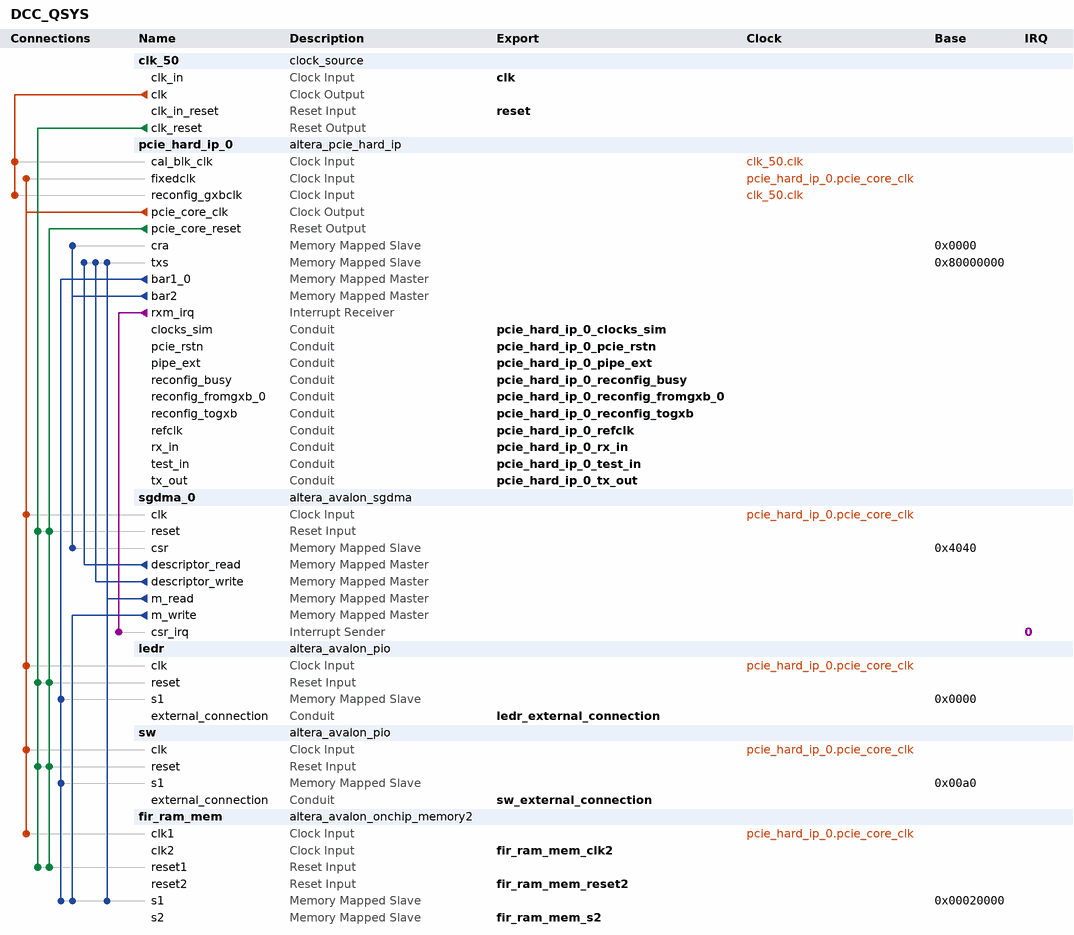
[diagram p0: system contents]
# Platform Designer (Qsys) system DCC_QSYS, Cyclone IV GX EP4CGX150DF31C7
# Parameters at their usual value, and those the tool derives, are not listed.
package require -exact qsys 14.0
create_system DCC_QSYS
set_project_property DEVICE_FAMILY {Cyclone IV GX}
set_project_property DEVICE EP4CGX150DF31C7

add_instance clk_50 clock_source 14.0
set_instance_parameter_value clk_50 clockFrequency 50000000

add_instance pcie_hard_ip_0 altera_pcie_hard_ip 14.0
set_instance_parameter_value pcie_hard_ip_0 p_pcie_test_out_width None
set_instance_parameter_value pcie_hard_ip_0 {BAR Type} {64 bit Prefetchable,Not used,32 bit Non-Prefetchable,Not used,Not used,Not used}
set_instance_parameter_value pcie_hard_ip_0 vendor_id 4466
set_instance_parameter_value pcie_hard_ip_0 device_id 57345
set_instance_parameter_value pcie_hard_ip_0 class_code 0
set_instance_parameter_value pcie_hard_ip_0 subsystem_vendor_id 4466
set_instance_parameter_value pcie_hard_ip_0 subsystem_device_id 4
set_instance_parameter_value pcie_hard_ip_0 my_advanced_errors false
set_instance_parameter_value pcie_hard_ip_0 my_enable_ecrc_check false
set_instance_parameter_value pcie_hard_ip_0 my_enable_ecrc_gen false
set_instance_parameter_value pcie_hard_ip_0 CG_NO_CPL_REORDERING 0
set_instance_parameter_value pcie_hard_ip_0 CG_ENABLE_A2P_INTERRUPT 0
set_instance_parameter_value pcie_hard_ip_0 p_user_msi_enable 0
set_instance_parameter_value pcie_hard_ip_0 CB_A2P_ADDR_MAP_PASS_THRU_BITS 31
set_instance_parameter_value pcie_hard_ip_0 {PCIe Address 63:32} 0x00000000,0x00000000,0x00000000,0x00000000,0x00000000,0x00000000,0x00000000,0x00000000,0x00000000,0x00000000,0x00000000,0x00000000,0x00000000,0x00000000,0x00000000,0x00000000
set_instance_parameter_value pcie_hard_ip_0 {PCIe Address 31:0} 0x00000000,0x00000000,0x00000000,0x00000000,0x00000000,0x00000000,0x00000000,0x00000000,0x00000000,0x00000000,0x00000000,0x00000000,0x00000000,0x00000000,0x00000000,0x00000000

add_instance sgdma_0 altera_avalon_sgdma 14.0
set_instance_parameter_value sgdma_0 enableBurstTransfers false
set_instance_parameter_value sgdma_0 enableUnalignedTransfers false
set_instance_parameter_value sgdma_0 readBlockDataWidth 32
set_instance_parameter_value sgdma_0 sinkErrorWidth 1
set_instance_parameter_value sgdma_0 sourceErrorWidth 0
set_instance_parameter_value sgdma_0 transferMode MEMORY_TO_MEMORY
set_instance_parameter_value sgdma_0 writeBurstcountWidth 4

add_instance ledr altera_avalon_pio 14.0
set_instance_parameter_value ledr direction Output
set_instance_parameter_value ledr width 18

add_instance sw altera_avalon_pio 14.0
set_instance_parameter_value sw captureEdge true
set_instance_parameter_value sw direction Input
set_instance_parameter_value sw width 18

add_instance fir_ram_mem altera_avalon_onchip_memory2 14.0
set_instance_parameter_value fir_ram_mem dataWidth 32
set_instance_parameter_value fir_ram_mem dualPort true
set_instance_parameter_value fir_ram_mem initMemContent true
set_instance_parameter_value fir_ram_mem initializationFileName onchip_mem.hex
set_instance_parameter_value fir_ram_mem memorySize 2048

# connections
add_connection clk_50.clk pcie_hard_ip_0.cal_blk_clk clock
add_connection clk_50.clk pcie_hard_ip_0.reconfig_gxbclk clock
add_connection pcie_hard_ip_0.pcie_core_clk fir_ram_mem.clk1 clock
add_connection pcie_hard_ip_0.pcie_core_clk ledr.clk clock
add_connection pcie_hard_ip_0.pcie_core_clk pcie_hard_ip_0.fixedclk clock
add_connection pcie_hard_ip_0.pcie_core_clk sgdma_0.clk clock
add_connection pcie_hard_ip_0.pcie_core_clk sw.clk clock
add_connection clk_50.clk_reset fir_ram_mem.reset1 reset
add_connection clk_50.clk_reset ledr.reset reset
add_connection clk_50.clk_reset sgdma_0.reset reset
add_connection clk_50.clk_reset sw.reset reset
add_connection pcie_hard_ip_0.pcie_core_reset fir_ram_mem.reset1 reset
add_connection pcie_hard_ip_0.pcie_core_reset ledr.reset reset
add_connection pcie_hard_ip_0.pcie_core_reset sgdma_0.reset reset
add_connection pcie_hard_ip_0.pcie_core_reset sw.reset reset
add_connection pcie_hard_ip_0.bar1_0 fir_ram_mem.s1 avalon
set_connection_parameter_value pcie_hard_ip_0.bar1_0/fir_ram_mem.s1 baseAddress 0x00020000
add_connection pcie_hard_ip_0.bar1_0 ledr.s1 avalon
set_connection_parameter_value pcie_hard_ip_0.bar1_0/ledr.s1 baseAddress 0x0000
add_connection pcie_hard_ip_0.bar1_0 sw.s1 avalon
set_connection_parameter_value pcie_hard_ip_0.bar1_0/sw.s1 baseAddress 0x00a0
add_connection pcie_hard_ip_0.bar2 pcie_hard_ip_0.cra avalon
set_connection_parameter_value pcie_hard_ip_0.bar2/pcie_hard_ip_0.cra baseAddress 0x0000
add_connection pcie_hard_ip_0.bar2 sgdma_0.csr avalon
set_connection_parameter_value pcie_hard_ip_0.bar2/sgdma_0.csr baseAddress 0x4040
add_connection sgdma_0.descriptor_read pcie_hard_ip_0.txs avalon
set_connection_parameter_value sgdma_0.descriptor_read/pcie_hard_ip_0.txs baseAddress 0x80000000
add_connection sgdma_0.descriptor_write pcie_hard_ip_0.txs avalon
set_connection_parameter_value sgdma_0.descriptor_write/pcie_hard_ip_0.txs baseAddress 0x80000000
add_connection sgdma_0.m_read fir_ram_mem.s1 avalon
set_connection_parameter_value sgdma_0.m_read/fir_ram_mem.s1 baseAddress 0x00020000
add_connection sgdma_0.m_read pcie_hard_ip_0.txs avalon
set_connection_parameter_value sgdma_0.m_read/pcie_hard_ip_0.txs baseAddress 0x80000000
add_connection sgdma_0.m_write fir_ram_mem.s1 avalon
set_connection_parameter_value sgdma_0.m_write/fir_ram_mem.s1 baseAddress 0x00020000
add_connection pcie_hard_ip_0.rxm_irq sgdma_0.csr_irq interrupt
set_connection_parameter_value pcie_hard_ip_0.rxm_irq/sgdma_0.csr_irq irqNumber 0

# exported interfaces
add_interface clk clock sink
set_interface_property clk EXPORT_OF clk_50.clk_in
add_interface reset reset sink
set_interface_property reset EXPORT_OF clk_50.clk_in_reset
add_interface sw_external_connection conduit end
set_interface_property sw_external_connection EXPORT_OF sw.external_connection
add_interface ledr_external_connection conduit end
set_interface_property ledr_external_connection EXPORT_OF ledr.external_connection
add_interface pcie_hard_ip_0_refclk conduit end
set_interface_property pcie_hard_ip_0_refclk EXPORT_OF pcie_hard_ip_0.refclk
add_interface pcie_hard_ip_0_test_in conduit end
set_interface_property pcie_hard_ip_0_test_in EXPORT_OF pcie_hard_ip_0.test_in
add_interface pcie_hard_ip_0_pcie_rstn conduit end
set_interface_property pcie_hard_ip_0_pcie_rstn EXPORT_OF pcie_hard_ip_0.pcie_rstn
add_interface pcie_hard_ip_0_clocks_sim conduit end
set_interface_property pcie_hard_ip_0_clocks_sim EXPORT_OF pcie_hard_ip_0.clocks_sim
add_interface pcie_hard_ip_0_pipe_ext conduit end
set_interface_property pcie_hard_ip_0_pipe_ext EXPORT_OF pcie_hard_ip_0.pipe_ext
add_interface pcie_hard_ip_0_reconfig_busy conduit end
set_interface_property pcie_hard_ip_0_reconfig_busy EXPORT_OF pcie_hard_ip_0.reconfig_busy
add_interface pcie_hard_ip_0_rx_in conduit end
set_interface_property pcie_hard_ip_0_rx_in EXPORT_OF pcie_hard_ip_0.rx_in
add_interface pcie_hard_ip_0_tx_out conduit end
set_interface_property pcie_hard_ip_0_tx_out EXPORT_OF pcie_hard_ip_0.tx_out
add_interface pcie_hard_ip_0_reconfig_togxb conduit end
set_interface_property pcie_hard_ip_0_reconfig_togxb EXPORT_OF pcie_hard_ip_0.reconfig_togxb
add_interface pcie_hard_ip_0_reconfig_fromgxb_0 conduit end
set_interface_property pcie_hard_ip_0_reconfig_fromgxb_0 EXPORT_OF pcie_hard_ip_0.reconfig_fromgxb_0
add_interface fir_ram_mem_s2 avalon slave
set_interface_property fir_ram_mem_s2 EXPORT_OF fir_ram_mem.s2
add_interface fir_ram_mem_clk2 clock sink
set_interface_property fir_ram_mem_clk2 EXPORT_OF fir_ram_mem.clk2
add_interface fir_ram_mem_reset2 reset sink
set_interface_property fir_ram_mem_reset2 EXPORT_OF fir_ram_mem.reset2

set_interconnect_requirement {$system} qsys_mm.clockCrossingAdapter HANDSHAKE
set_interconnect_requirement {$system} qsys_mm.maxAdditionalLatency 1

save_system DCC_QSYS.qsys
